# EAGLE design standalone-wifi-module-v1 (EAGLE 6.6.0)
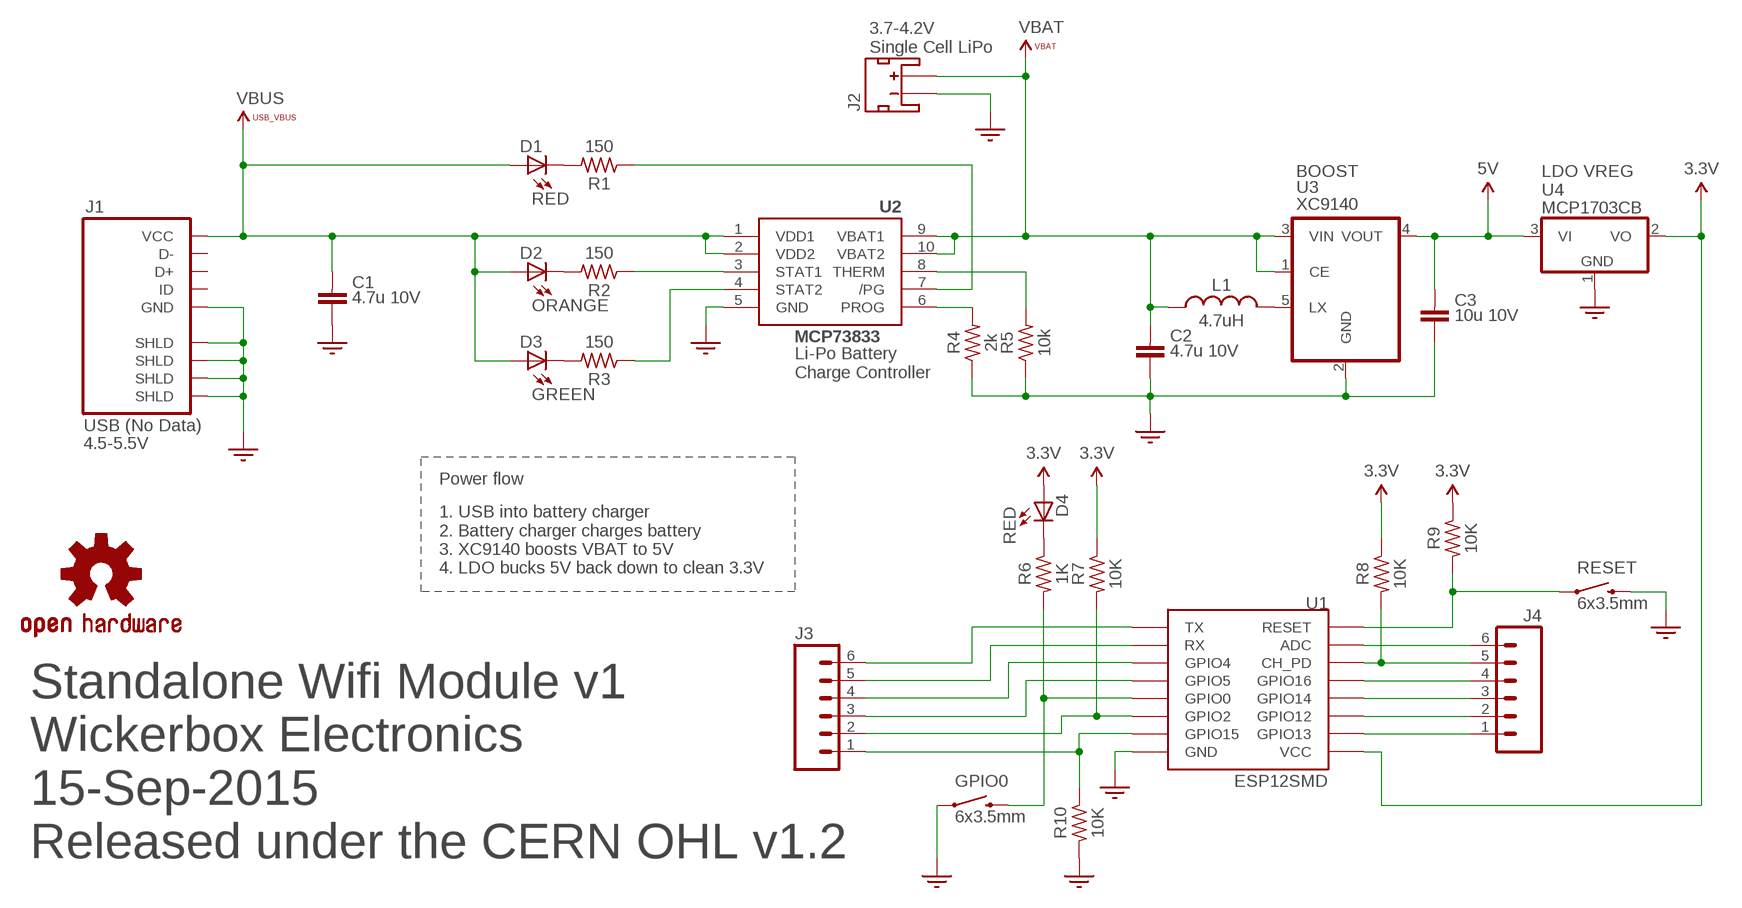
[diagram p0: schematic, sheet 1]

## Parts
C1  4.7u 10V  CAP-0805  [RLC-0805]
C2  4.7u 10V  CAP-0603  [RLC-0603]
C3  10u 10V  CAP-0603  [RLC-0603]
D1  RED  BG1111C  [LED0603]
D2  ORANGE  BG1111C  [LED0603]
D3  GREEN  BG1111C  [LED0603]
D4  RED  BG1111C  [LED0603]
GPIO0  6x3.5mm  SWITCH-MOMENTARY-2SMD-1101NE  [TACTILE-SWITCH-1101NE]
J1  USB (No Data)  ZX62D-B-5P8  [ZX62D-B-5P8]
J2  JST_2MM_MALE  [JST-2-SMD]
J3  M06LOCK_LONGPADS  [1X06_LOCK_LONGPADS]
J4  M06LOCK_LONGPADS  [1X06_LOCK_LONGPADS]
L1  4.7uH  IND-0805  [RLC-0805]
R1  150  RES-0402  [RLC-0402]
R2  150  RES-0402  [RLC-0402]
R3  150  RES-0402  [RLC-0402]
R4  2k  RES-0402  [RLC-0402]
R5  10k  RES-0402  [RLC-0402]
R6  1K  RES-0402  [RLC-0402]
R7  10K  RES-0402  [RLC-0402]
R8  10K  RES-0402  [RLC-0402]
R9  10K  RES-0402  [RLC-0402]
R10  10K  RES-0402  [RLC-0402]
RESET  6x3.5mm  SWITCH-MOMENTARY-2SMD-1101NE  [TACTILE-SWITCH-1101NE]
U1  ESP12SMD  [ESP12_SMD]
U2  MCP73833-UN  [MSOP10]
U3  XC9140  [SOT-25]
U4  MCP1703CB  [SOT23]
U$2  OSHW_LOGO_SYMM  [OSHW_LOGO_MED_SYM]

## Nets
3.3V: D4.A R7.1 R8.1 R9.1 U1.VCC U4.2(VO)
5V: C3.2 U3.4(VOUT) U4.3(VI)
!RESET: R9.2 RESET.1 U1.RESET
ADC: J4.6 U1.ADC
CH_PD: J4.5 R8.2 U1.CH_PD
GND: C1.2 C2.1 C3.1 GPIO0.1 J1.P5(GND) J1.P$1(SHLD) J1.P$2(SHLD) J1.P$3(SHLD) J1.P$4(SHLD) J2.1(-) R4.1 R5.1 R10.2 RESET.2 U1.GND U2.5(GND) U3.2(GND) U4.1(GND)
GPIO0: GPIO0.2 R6.2 U1.GPIO0
GPIO2: J3.2 R7.2 U1.GPIO2
GPIO4: J3.4 U1.GPIO4
GPIO5: J3.3 U1.GPIO5
GPIO12: J4.2 U1.GPIO12
GPIO13: J4.1 U1.GPIO13
GPIO14: J4.3 U1.GPIO14
GPIO15: J3.1 R10.1 U1.GPIO15
GPIO16: J4.4 U1.GPIO16
N$3: D4.C R6.1
N$10: L1.2 U3.5(LX)
N$13: D2.C R2.2
N$14: D3.C R3.2
N$20: D1.C R1.2
PG: R1.1 U2.7(/PG)
PROG: R4.2 U2.6(PROG)
RX: J3.5 U1.RX
STAT1: R2.1 U2.3(STAT1)
STAT2: R3.1 U2.4(STAT2)
THERM: R5.2 U2.8(THERM)
TX: J3.6 U1.TX
VBAT: C2.2 J2.2(+) L1.1 U2.9(VBAT1) U2.10(VBAT2) U3.1(CE) U3.3(VIN)
VBUS: C1.1 D1.A D2.A D3.A J1.P1(VCC) U2.1(VDD1) U2.2(VDD2)
Unconnected: J1.P2(D-) J1.P3(D+) J1.P4(ID) J2.NC1(PAD1) J2.NC2(PAD2)

## Notes on the sheet
- 3.7-4.2V
  Single Cell LiPo
- BOOST | LDO VREG
- Li-Po Battery
  Charge Controller
- 4.5-5.5V
- Power flow
- 1. USB into battery charger
  2. Battery charger charges battery
  3. XC9140 boosts VBAT to 5V
  4. LDO bucks 5V back down to clean 3.3V
- Standalone Wifi Module v1
  Wickerbox Electronics
  15-Sep-2015
  Released under the CERN OHL v1.2

## Library data of the parts
C1 = max-viz:CAP-0805
C2 C3 = max-viz:CAP-0603
D1-D4 = max-viz:BG1111C
GPIO0 RESET = SparkFun-Electromechanical:SWITCH-MOMENTARY-2: Various NO switches- pushbuttons, reed, etc; PROD_ID: SWCH-00815
J1 = con-hirose-microusb:ZX62D-B-5P8
J2 = SparkFun-Connectors:JST_2MM_MALE: Mates to single-cell LiPo batteries. CONN-08352; PROD_ID: CONN-08352
J3 J4 = SparkFun-Connectors:M06: Header 6 Standard 6-pin 0.1" header. Use with straight break away headers (SKU : PRT-00116), right angle break away headers (PRT-00553), swiss pins (PRT-00743), machine pins (PRT-00117), and female headers (PRT-00115). Molex polarized connector foot print use with SKU : PRT-08094 with associated crimp pins and housings. NOTES ON THE VARIANTS LOCK and LOCK_LONGPADS... This footprint was designed to help hold the alignment of a through-hole component (i.e. 6-pin header) while soldering it into place. You may notice that each hole has been shifted either up or down by 0.005 of an inch from it's more standard position (which is a perfectly straight line). This slight alteration caused the pins (the squares in the middle) to touch the edges of the holes. Because they are alternating, it causes a "brace" to hold the component in place. 0.005 has proven to be the perfect amount of "off-center" position when using our standard breakaway headers. Although looks a little odd when you look at the bare footprint, once you have a header in there, the alteration is very hard to notice. Also,if you push a header all the way into place, it is covered up entirely on the bottom side. This idea of altering the position of holes to aid alignment will be further integrated into the Sparkfun Library for other footprints. It can help hold any component with 3 or more connection pins.
L1 = max-viz:IND-0805
R1-R10 = max-viz:RES-0402
U1 = esp8266modules:ESP12: ESP8266 Wifi module 12
U2 = adafruit:MCP73833
U3 = max-viz:XC9140
U4 = linear:MCP1703: 250 mA, 16V, Low Quiescent Current LDO Regulator Source: http://ww1.microchip.com/downloads/en/DeviceDoc/22049b.pdf
U$2 = PatternAgents-Logos:OSHW_LOGO_SYM: OSHW_LOGO_SYM Source : http://freedomdefined.org/OSHW#Logo_repository Github : https://github.com/PatternAgents/PCB_Libraries License : http://creativecommons.org/licenses/by-sa/3.0/ (Creative Commons 3.0) THIS SOFTWARE IS PROVIDED BY THE CONTRIBUTORS "AS IS" AND WITHOUT ANY EXPRESS OR IMPLIED WARRANTIES, INCLUDING, BUT NOT LIMITED TO, THE IMPLIED WARRANTIES OF MERCHANTABILITY AND FITNESS FOR A PARTICULAR PURPOSE ARE DISCLAIMED. IN NO EVENT SHALL THE COPYRIGHT OWNER OR CONTRIBUTORS BE LIABLE FOR ANY DIRECT, INDIRECT, INCIDENTAL, SPECIAL, EXEMPLARY, OR CONSEQUENTIAL DAMAGES (INCLUDING, BUT NOT LIMITED TO, PROCUREMENT OF SUBSTITUTE GOODS OR SERVICES; LOSS OF USE, DATA, OR PROFITS; OR BUSINESS INTERRUPTION) HOWEVER CAUSED AND ON ANY THEORY OF LIABILITY, WHETHER IN CONTRACT, STRICT LIABILITY, OR TORT (INCLUDING NEGLIGENCE OR OTHERWISE) ARISING IN ANY WAY OUT OF THE USE OF THIS SOFTWARE, EVEN IF ADVISED OF THE POSSIBILITY OF SUCH DAMAGE.

## Board
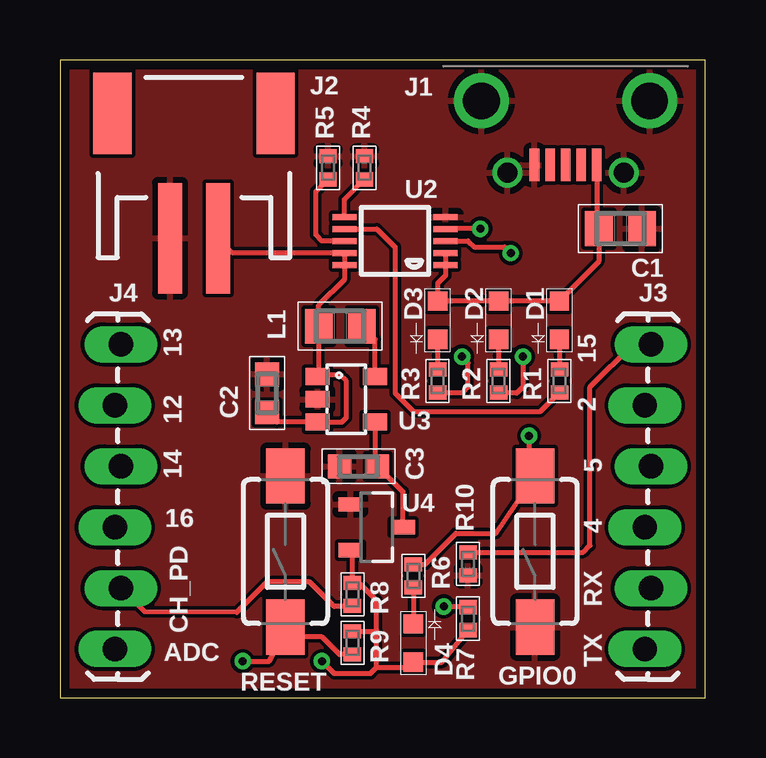
[diagram p1: board, top side]
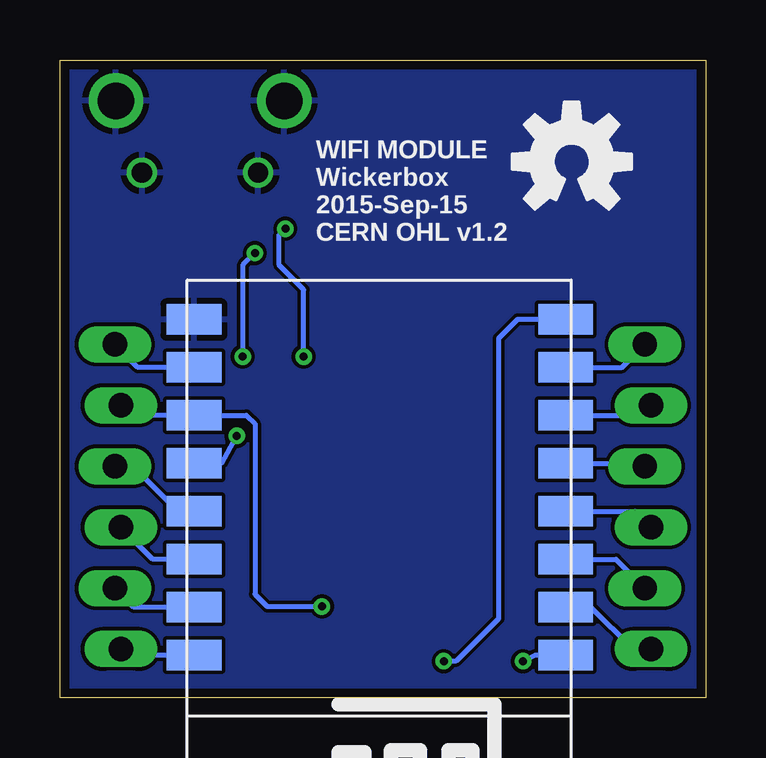
[diagram p2: board, bottom side, seen from below]

Size 26.9 x 26.59 mm. Coordinates in mm from the lower left corner, seen from the top.
Outline: 0,0 26.9,0 26.9,26.59 0,26.59 0,0
Copper layers (1*16): Top 0.0356mm / dielectric 1.5011mm / Bottom 0.0356mm
Design rules "oshpark-2layer": minimum track width 6mil, minimum drill 13mil, track to track 6mil, track to pad 6mil, pad to pad 6mil, via to via 6mil, smd to smd 6mil, copper to edge 15mil, drill to drill 6mil, minimum pad ring 7mil, minimum via ring 7mil, stop-mask expansion 4mil, vias tented up to drill 0mil, thermal gap 10mil

### Footprints (pad centres in the part's own frame; a part is rotated, then mirrored left to right if it is on the bottom)
RLC-0805 = smd 1.15 x 1.45: 1 -0.9,0; 2 0.9,0
RLC-0603 = smd 0.95 x 1: 1 0.8,0; 2 -0.8,0
LED0603 = smd 0.8 x 0.8: A 0,0.8; C 0,-0.8
TACTILE-SWITCH-1101NE = smd 2.3 x 1.6: 1 -3.15,0; 2 3.15,0
ZX62D-B-5P8 = smd 0.4 x 1.35: P1 -1.3,2.675; P2 -0.65,2.675; P3 0,2.675; P4 0.65,2.675; P5 1.3,2.675 | drill 1.524: P$1 3.51,0; P$2 -3.51,0 | drill 0.838: P$3 -2.425,3; P$4 2.425,3
JST-2-SMD = smd 1 x 4.6: 1 -1,-3.7; 2 1,-3.7 | smd 1.6 x 3.4: NC1 -3.4,1.5; NC2 3.4,1.5
1X06_LOCK_LONGPADS = drill 1.016 long: 1 0,0; 2 2.54,-0.254; 3 5.08,0; 4 7.62,-0.254; 5 10.16,0; 6 12.7,-0.254
RLC-0402 = smd 0.59 x 0.72: 1 -0.48,0; 2 0.48,0
ESP12_SMD = smd 2.286 x 1.27: ADC -7.874,3.842; CH_PD -7.874,1.842; GND 7.62,-8.158; GPIO0 7.62,-2.158; GPIO2 7.62,-4.158; GPIO4 7.62,1.842; GPIO5 7.62,-0.158; GPIO12 -7.874,-4.158; GPIO13 -7.874,-6.158; GPIO14 -7.874,-2.158; GPIO15 7.62,-6.158; GPIO16 -7.874,-0.158; RESET -7.874,5.842; RX 7.62,3.842; TX 7.62,5.842; VCC -7.874,-8.158
MSOP10 = smd 0.25 x 1: 1 -1,-2.113; 2 -0.5,-2.113; 3 0,-2.113; 4 0.5,-2.113; 5 1,-2.113; 6 1,2.113; 7 0.5,2.113; 8 0,2.113; 9 -0.5,2.113; 10 -1,2.113
SOT-25 = smd 0.7 x 1: 1 -0.95,-1.2; 2 0,-1.2; 3 0.95,-1.2; 4 0.95,1.2; 5 -0.95,1.2
SOT23 = smd 0.6 x 1: 1 -0.95,-1.1; 2 0.95,-1.1; 3 0,1.1

### Placement (x,y rotation side)
C1  23.37,19.56 0 top
C2  8.64,12.7 90 top
C3  12.45,9.65 180 top
D1  20.83,15.75 0 top
D2  18.29,15.75 0 top
D3  15.75,15.75 0 top
D4  14.73,2.29 180 top
GPIO0  19.81,6.1 90 top
J1  21.08,24.89 180 top
J2  5.59,22.86 0 top
J3  24.64,14.73 270 top
J4  2.54,14.73 270 top
L1  11.68,15.49 0 top
R1  20.83,13.21 90 top
R2  18.29,13.21 90 top
R3  15.75,13.21 90 top
R4  12.7,22.1 270 top
R5  11.18,22.1 270 top
R6  14.73,5.08 90 top
R7  17.02,3.3 90 top
R8  12.19,4.32 270 top
R9  12.19,2.29 270 top
R10  17.02,5.59 270 top
RESET  9.4,6.1 90 top
U1  13.72,7.62 180 bottom
U2  13.97,19.05 90 top
U3  11.94,12.45 270 top
U4  13.21,7.11 270 top
U$2  5.59,22.35 0 bottom

### Tracks (layer width: path | path; a pad name or v marks a point on that pad's centre or on a via)
3.3V  (via drill 0.33)
  Top 0.203: U4.2 12.19,5.82 R8.1 12.47,4.8 13.21,4.06 13.21,2.79 13.18,2.77 | v10.92,1.52 11.43,1.02 12.95,1.02 13.21,1.27 | 13.21,1.27 13.21,2.74 13.18,2.77 | 13.21,1.27 14.52,1.27 D4.A 15.94,1.49 R7.1 | R9.1 13.18,2.77
  Bottom 0.203: U1.VCC 7.84,15.78 8.64,14.99 8.64,3.3 10.41,1.52 v10.92,1.52
5V
  Top 0.203: U4.3 14.31,8.59 C3.2 13.14,9.76 U3.4
!RESET  (via drill 0.33)
  Top 0.203: v7.62,1.52 8.74,1.52 RESET.1 9.8,2.54 10.92,2.54 11.66,1.81 R9.2
  Bottom 0.203: U1.RESET 7.11,1.78 v7.62,1.52
ADC
  Bottom 0.203: U1.ADC 4.79,3.78 3.05,2.03 J4.6
CH_PD
  Top 0.203: R8.2 12.19,3.81 11.43,3.81 10.41,4.83 8.64,4.83 7.37,3.56 3.53,3.58 J4.5
  Bottom 0.203: U1.CH_PD 3.75,5.78 J4.5
GND
  pour Bottom: 0,-0.25 27.18,-0.25 27.18,26.67 0,26.67
  pour Top: 0,-0.25 27.18,-0.25 27.18,26.67 0,26.67
GPIO0  (via drill 0.33)
  Top 0.203: R6.2 15.21,5.56 16.51,6.86 18.19,6.86 GPIO0.2 19.56,8.74 v19.56,10.92
  Bottom 0.203: U1.GPIO0 20.19,9.78 v19.56,10.92
GPIO2  (via drill 0.33)
  Top 0.203: v16,3.81 17.24,3.81 R7.2
  Bottom 0.203: J3.2 23.97,11.78 U1.GPIO2 19.14,11.78 18.8,11.43 18.8,4.32 18.29,3.81 v16,3.81
GPIO4
  Bottom 0.203: U1.GPIO4 23.05,5.78 J3.4
GPIO5
  Bottom 0.203: U1.GPIO5 22,7.78 23.88,9.65 J3.3
GPIO12
  Bottom 0.203: U1.GPIO12 2.7,11.78 J4.2
GPIO13
  Bottom 0.203: U1.GPIO13 3.49,13.78 J4.1
GPIO14
  Bottom 0.203: U1.GPIO14 2.67,9.78 J4.3
GPIO15
  Top 0.203: R10.1 21.82,6.07 22.1,6.35 22.1,12.95 23.88,14.73 J3.1
  Bottom 0.203: U1.GPIO15 23.68,13.78 J3.1
GPIO16
  Bottom 0.203: U1.GPIO16 2.95,7.78 J4.4
N$3
  Top 0.203: R6.1 D4.C
N$10
  Top 0.203: U3.5 13.14,14.94 L1.2
N$13
  Top 0.203: D2.C R2.2
N$14
  Top 0.203: D3.C R3.2
N$20
  Top 0.203: D1.C R1.2
PG
  Top 0.203: U2.7 13.22,19.55 13.97,18.8 13.97,12.7 14.73,11.94 20.04,11.94 R1.1
PROG
  Top 0.203: U2.6 11.86,20.77 R4.2
RX
  Bottom 0.203: U1.RX 23.84,3.78 J3.5
STAT1  (via drill 0.33)
  Top 0.203: U2.3 17.02,19.05 17.27,18.8 18.54,18.8 v18.8,18.54 | v19.3,14.22 19.3,12.95 19.05,12.7 18.32,12.7 R2.1
  Bottom 0.203: v18.8,18.54 19.3,18.03 v19.3,14.22
STAT2  (via drill 0.33)
  Top 0.203: R3.1 16.79,12.73 17.02,12.95 17.02,13.97 v16.76,14.22 | v17.53,19.56 16.09,19.56 U2.4
  Bottom 0.203: v16.76,14.22 16.76,17.02 17.78,18.03 17.78,19.3 v17.53,19.56
THERM
  Top 0.203: U2.8 10.92,19.05 10.67,19.3 10.67,21.11 R5.2
TX
  Bottom 0.203: U1.TX 24.13,1.78 J3.6
VBAT
  Top 0.203: C2.2 9.04,11.5 U3.3 11.75,11.5 11.94,11.68 11.94,13.21 11.68,13.46 10.8,13.46 | 10.8,13.46 U3.1 | 10.8,13.46 10.8,15.47 L1.1 10.78,16.37 11.86,17.45 U2.10 U2.9 7.2,18.55 J2.2
VBUS
  Top 0.203: J1.P1 22.38,19.9 C1.1 22.47,18.19 D1.A D2.A D3.A 15.75,17.27 16.08,17.61 U2.1 U2.2

### Text on the board
tPlace: 13 | 15 | 2 | 12 | 14 | 5 | 16 | 4 | CH_PD | RX | ADC | TX
bPlace: WIFI MODULE / Wickerbox / 2015-Sep-15 / CERN OHL v1.2